# EAGLE design pc_vl53l0c_brk (EAGLE 6.4)
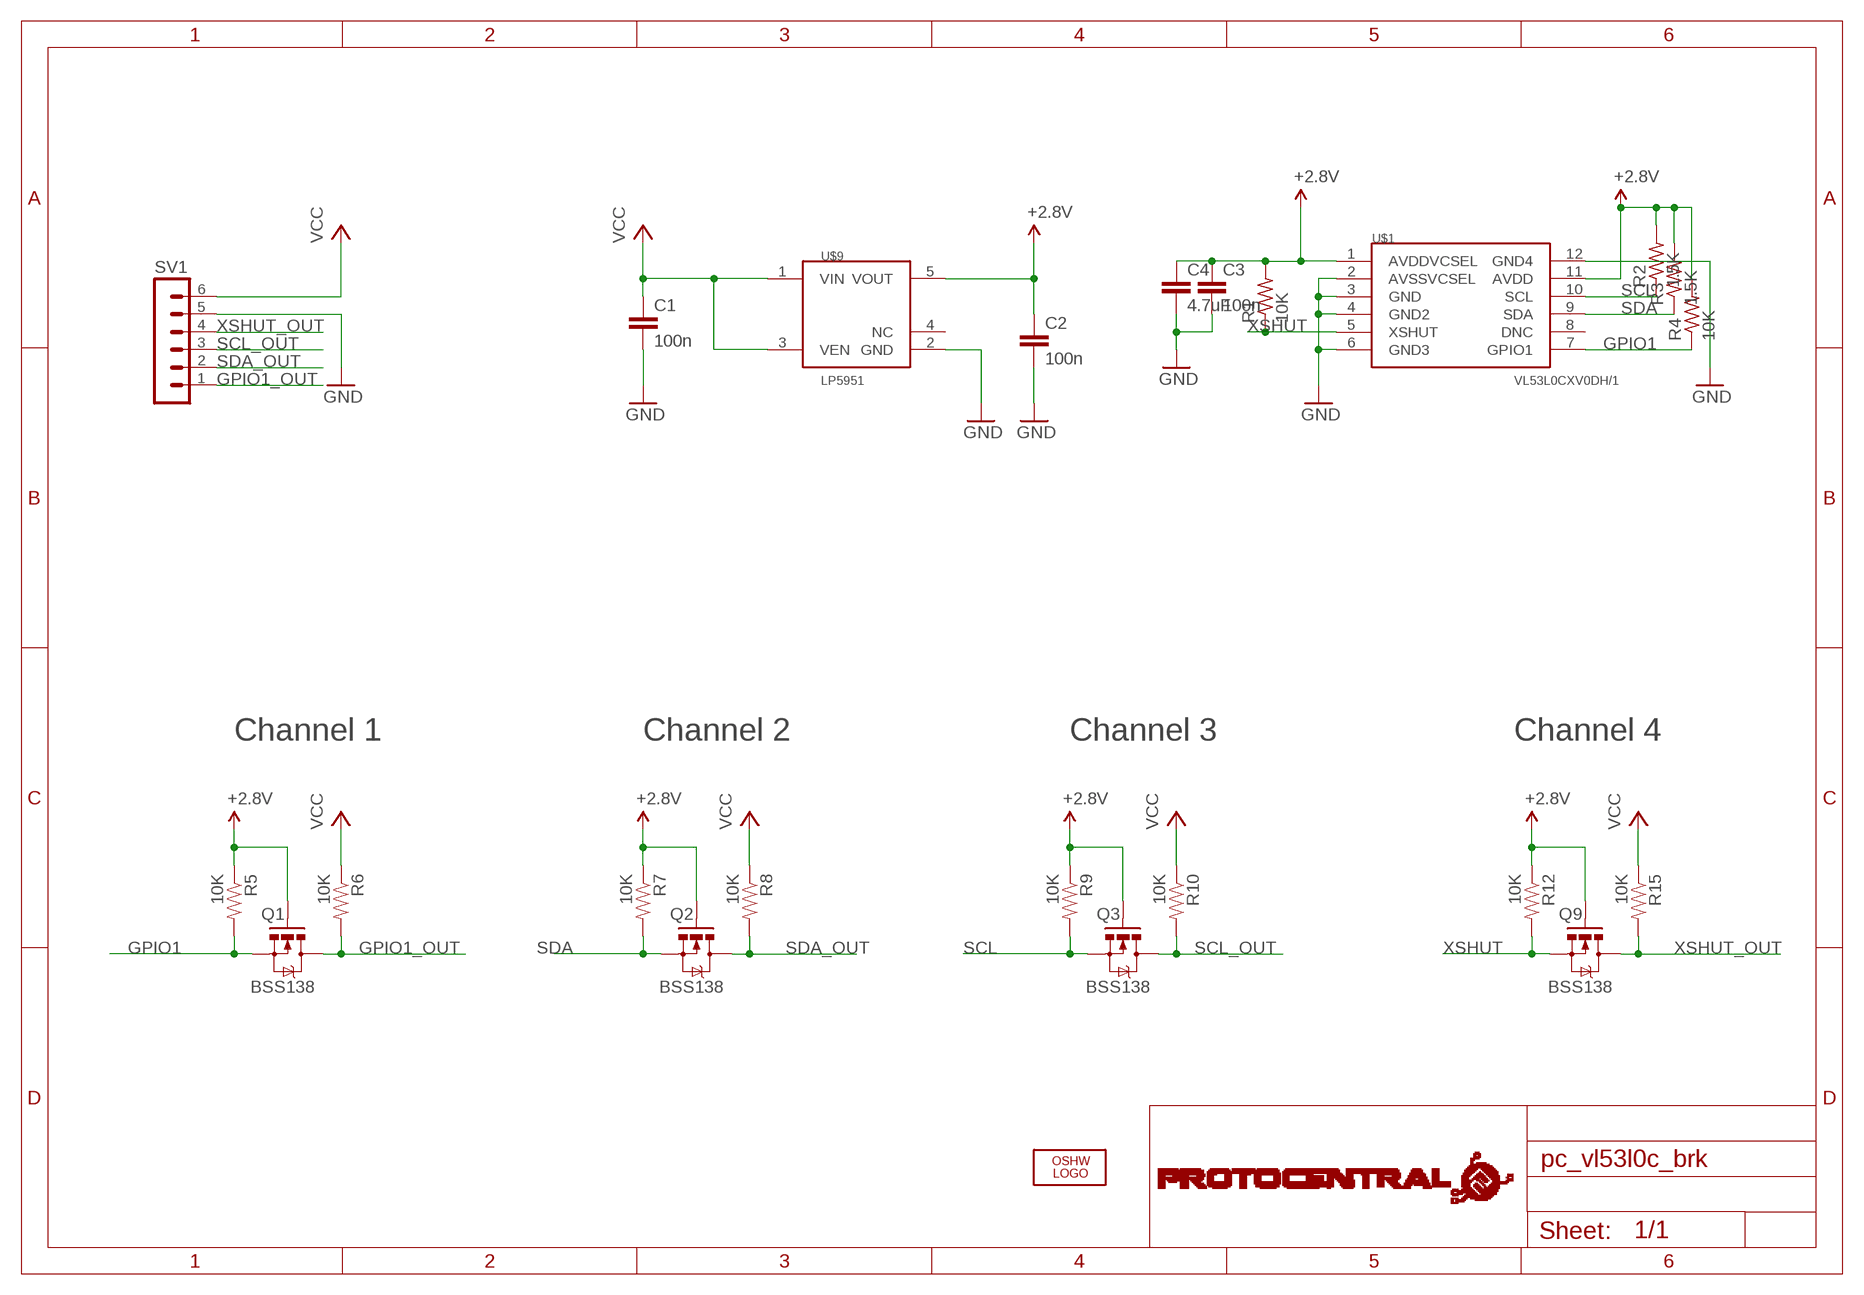
[diagram p0: schematic, sheet 1]

## Parts
C1  100n  C-EUC0402  [C0402]
C2  100n  C-EUC0402  [C0402]
C3  100n  C-EUC0402  [C0402]
C4  4.7uF  C-EUC0402  [C0402]
LOGO2  OSHW_LOGO_FILLX0100-NT  [OSHW_FILLX100_NOTEXT]
Q1  BSS138  MOSFET-NCHANNELSMD  [SOT23-3]
Q2  BSS138  MOSFET-NCHANNELSMD  [SOT23-3]
Q3  BSS138  MOSFET-NCHANNELSMD  [SOT23-3]
Q9  BSS138  MOSFET-NCHANNELSMD  [SOT23-3]
R1  10K  R-US_R0805  [R0805]
R2  1.5K  R-US_R0805  [R0805]
R3  1.5K  R-US_R0805  [R0805]
R4  10K  R-US_R0805  [R0805]
R5  10K  RESISTOR0805-RES  [0805]
R6  10K  RESISTOR0805-RES  [0805]
R7  10K  RESISTOR0805-RES  [0805]
R8  10K  RESISTOR0805-RES  [0805]
R9  10K  RESISTOR0805-RES  [0805]
R10  10K  RESISTOR0805-RES  [0805]
R12  10K  RESISTOR0805-RES  [0805]
R15  10K  RESISTOR0805-RES  [0805]
SV1  MA06-1  [MA06-1]
U$1  VL53L0CXV0DH/1  [LGA-12]
U$9  LP5951  [SC70-5]
U$10  PROTY_LOGO_WITH_TEXT  [PROTY_WITH_TEXT]

## Nets
+2.8V: C2.1 C3.1 C4.1 Q1.1(G) Q2.1(G) Q3.1(G) Q9.1(G) R1.2 R2.2 R3.2 R4.2 R5.1 R7.1 R9.1 R12.1 U$1.1(AVDDVCSEL) U$1.11(AVDD) U$9.5(VOUT)
GND: C1.2 C2.2 C3.2 C4.2 SV1.5 U$1.2(AVSSVCSEL) U$1.3(GND) U$1.4(GND2) U$1.6(GND3) U$1.12(GND4) U$9.2(GND)
GPIO1: Q1.2(S) R4.1 R5.2 U$1.7(GPIO1)
GPIO1_OUT: Q1.3(D) R6.2 SV1.1
SCL: Q3.2(S) R2.1 R9.2 U$1.10(SCL)
SCL_OUT: Q3.3(D) R10.2 SV1.3
SDA: Q2.2(S) R3.1 R7.2 U$1.9(SDA)
SDA_OUT: Q2.3(D) R8.2 SV1.2
VCC: C1.1 R6.1 R8.1 R10.1 R15.1 SV1.6 U$9.1(VIN) U$9.3(VEN)
XSHUT: Q9.2(S) R1.1 R12.2 U$1.5(XSHUT)
XSHUT_OUT: Q9.3(D) R15.2 SV1.4
Unconnected: U$1.8(DNC) U$9.4(NC)

## Notes on the sheet
- Channel 1 | Channel 2 | Channel 3 | Channel 4

## Library data of the parts
C1-C4 = rcl:C-EU: CAPACITOR, European symbol
LOGO2 = ohw-logo:OSHW_LOGO_FILL
Q1-Q3 Q9 = SparkFun:MOSFET-NCHANNEL
R1-R4 = rcl:R-US_: RESISTOR, American symbol
R5-R10 R12 R15 = SparkFun:RESISTOR: Resistor Basic schematic elements and footprints for 0603, 1206, and PTH resistors.
SV1 = con-lstb:MA06-1: PIN HEADER; OC_FARNELL: unknown; OC_NEWARK: unknown
U$1 = circuitects:VL53L0CXV0DH/1
U$9 = circuitects:LP5951
U$10 = circuitects:PROTY_LOGO_WITH_TEXT

## Board
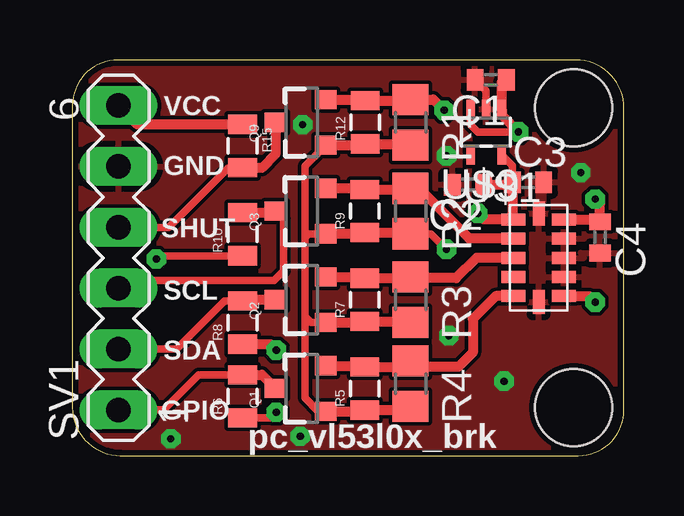
[diagram p1: board, top side]
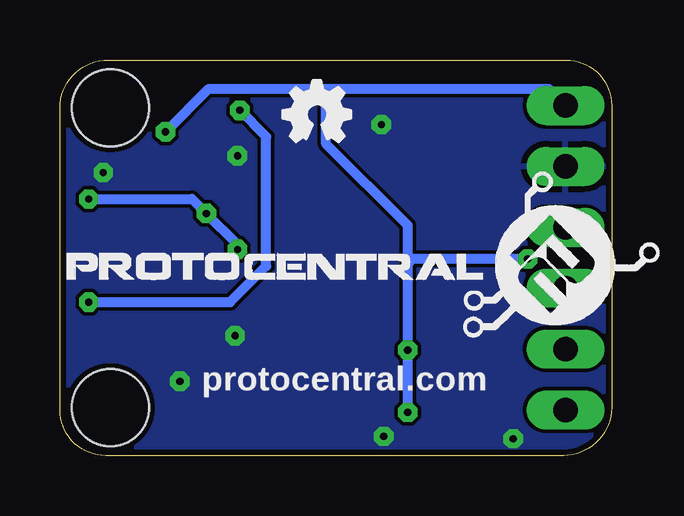
[diagram p2: board, bottom side, seen from below]

Size 23 x 16.5 mm. Coordinates in mm from the lower left corner, seen from the top.
Outline: 2,0 21.1,0 arc90 23,1.9 23,14.5 arc90 21,16.5 1.9,16.5 arc90 0,14.6 0,2 arc90 2,0
Copper layers (1*2*15*16): Top 0.035mm / dielectric 1.5mm / Route2 0.035mm / dielectric 0.15mm / Route15 0.035mm / dielectric 0.2mm / Bottom 0.035mm
Design rules "Circuitects-Rules": minimum track width 6mil, minimum drill 0.3mm, track to track 6mil, track to pad 6mil, pad to pad 6mil, via to via 6mil, smd to smd 6mil, copper to edge 10mil, drill to drill 8mil, minimum pad ring 12mil, minimum via ring 10mil, stop-mask expansion 4mil, vias tented up to drill 25mil, thermal gap 10mil
Holes 3.2 mm at 20.9,14.5 20.9,2

### Footprints (pad centres in the part's own frame; a part is rotated, then mirrored left to right if it is on the bottom)
C0402 = smd 0.7 x 0.9: 1 -0.65,0; 2 0.65,0
SOT23-3 = smd 0.8 x 0.9: 1 -0.95,-1; 2 0.95,-1; 3 0,1.1
R0805 = smd 1.3 x 1.5: 1 -0.95,0; 2 0.95,0
0805 = smd 0.8 x 1.2: 1 -0.9,0; 2 0.9,0
MA06-1 = drill 1.016 long: 1 -6.35,0; 2 -3.81,0; 3 -1.27,0; 4 1.27,0; 5 3.81,0; 6 6.35,0
LGA-12 = smd 1 x 0.5: 1 1.05,1.6; 2 1.05,0.8; 3 1.05,0; 4 1.05,-0.8; 5 1.05,-1.6; 7 -1.05,-1.6; 8 -1.05,-0.8; 9 -1.05,0; 10 -1.05,0.8; 11 -1.05,1.6 | smd 0.5 x 1: 6 0,-1.85; 12 0,1.85
SC70-5 = smd 0.35 x 0.8: 1 -0.65,-0.95; 2 0,-0.95; 3 0.65,-0.95; 4 0.65,0.95; 5 -0.65,0.95

### Placement (x,y rotation side)
C1  17.44,15.67 180 top
C2  16.5,11.3 180 top
C3  19,11.4 0 top
C4  22,9.1 270 top
LOGO2  13.7,13.1 0 bottom
Q1  9.57,2.8 90 top
Q2  9.57,6.5 90 top
Q3  9.57,10.2 90 top
Q9  9.57,13.9 90 top
R1  14.1,13.9 270 top
R2  14.1,10.2 270 top
R3  14.1,6.5 270 top
R4  14.1,3 270 top
R5  12.19,2.8 90 top
R6  7.09,2.47 90 top
R7  12.19,6.5 90 top
R8  7.09,5.55 90 top
R9  12.19,10.2 90 top
R10  7.09,9.23 90 top
R12  12.21,13.9 90 top
R15  7.09,12.91 270 top
SV1  1.92,8.25 90 top
U$1  19.44,8.25 0 top
U$9  17.25,13.49 180 top
U$10  22.7,5.3 0 bottom

### Tracks (layer width: path | path; a pad name or v marks a point on that pad's centre or on a via)
+2.8V  (via drill 0.3)
  Top 0.305: Q1.1 10.25,1.85 9.7,2.4 9.7,5.8 | 9.7,5.8 9.7,9.1 | 9.7,9.1 9.7,12.08 Q9.1 | Q3.1 9.85,9.25 9.7,9.1 | Q2.1 9.95,5.55 9.7,5.8 | R2.2 14.95,9.25 v15.6,8.6 | C3.1 18.35,12.09 U$9.5
  Top 0.406: Q1.1 12.14,1.85 R5.1 14.05,1.9 R4.2 | Q2.1 12.14,5.55 R7.1 14.05,5.6 R3.2 | R2.2 14.05,9.3 R9.1 12.14,9.25 Q3.1 | Q9.1 12.16,12.95 R12.1 14.05,13 R1.2 | v16.9,10.1 17.15,9.85 U$1.11 18.35,9.89 C3.1 18.25,11.3 C2.1 | U$1.1 21.9,9.85 C4.1 22,10.5 v21.8,10.7
  Bottom 0.406: v21.8,10.7 17.5,10.7 v16.9,10.1 15.6,8.8 v15.6,8.6
GND  (via drill 0.3)
  Top 0.305: U$9.2 17.25,15.21 C1.2
  other vias: 18,3.1 15.7,5 9.6,13.8 21.2,11.8 9.5,0.8 15.6,12.5 4.1,0.7
  pour Bottom: 0.1,16.5 23.1,16.5 23.1,0 0.1,0
  pour Top: 0.1,16.5 23.1,16.5 23.1,0 0.1,0
GPIO1
  Top 0.406: Q1.2 12.14,3.75 R5.2 14.05,3.7 R4.1 14.15,3.7 16.1,3.7 16.7,4.3 16.7,5.7 17.65,6.65 U$1.7
GPIO1_OUT
  Top 0.305: R6.2 5.27,3.37 4.3,2.4 4,2.1 3.8,1.9 SV1.1
  Top 0.406: R6.2 7.9,3.37 Q1.3
SCL
  Top 0.406: Q3.2 12.14,11.15 R9.2 14.05,11.1 R2.1 14.45,11.15 16.55,9.05 U$1.10
SCL_OUT
  Top 0.305: SV1.3 3.08,6.98 3.4,7.3 8.4,7.3 8.8,7.7 8.8,9.87 Q3.3
  Top 0.406: R10.2 8.4,10.13 Q3.3
SDA
  Top 0.406: Q2.2 12.14,7.45 R7.2 14.05,7.4 R3.1 14.15,7.4 16,7.4 16.85,8.25 U$1.9
SDA_OUT
  Top 0.305: R8.2 6.35,6.45 4.85,4.95 4.7,4.8 4.34,4.44 SV1.2
  Top 0.406: Q2.3 7.14,6.5 R8.2
VCC  (via drill 0.3)
  Top 0.305: R10.1 3.63,8.33 v3.5,8.2 | U$9.3 16.6,13.8 16.9,13.5 v18.6,13.5 | R6.1 8.27,1.57 v8.5,1.8
  Top 0.406: R15.1 2.71,13.81 SV1.6 | R8.1 8.25,4.65 v8.5,4.4 | C1.1 17.9,15.56 U$9.1 17.9,14.2 v18.6,13.5
  Bottom 0.406: v8.5,1.8 v8.5,4.4 8.5,8 | 11.7,15.3 16.8,15.3 v18.6,13.5 | 11.7,15.3 2.62,15.3 SV1.6 | 8.5,8 8.5,9.6 11.9,13 11.9,15.1 11.7,15.3 | v3.5,8.2 8.3,8.2 8.5,8
XSHUT  (via drill 0.3)
  Top 0.406: Q9.2 12.16,14.85 R12.2 14.05,14.8 R1.1 15.05,14.85 v15.5,14.4 | U$1.5 21.55,6.65 v21.8,6.4
  Bottom 0.406: v21.8,6.4 15.9,6.4 14.4,7.9 14.4,13.3 v15.5,14.4
XSHUT_OUT
  Top 0.305: R15.2 6.5,12 4.02,9.52 SV1.4
  Top 0.406: Q9.3 8.47,12.57 7.9,12 R15.2

### Text on the board
tPlace: VCC | GND | SHUT | SCL | SDA | GPIO | pc_vl53l0x_brk
bPlace: protocentral.com